# EasyEDA schematic SCH_3-14-Pi-day-PCB_2024-06-02.json
TITLE: Sheet_1; REV: 1.0; Date: 2024-03-14; Sheet: 1/1; Drawn By: emaildivyagarg; Company: Your Company
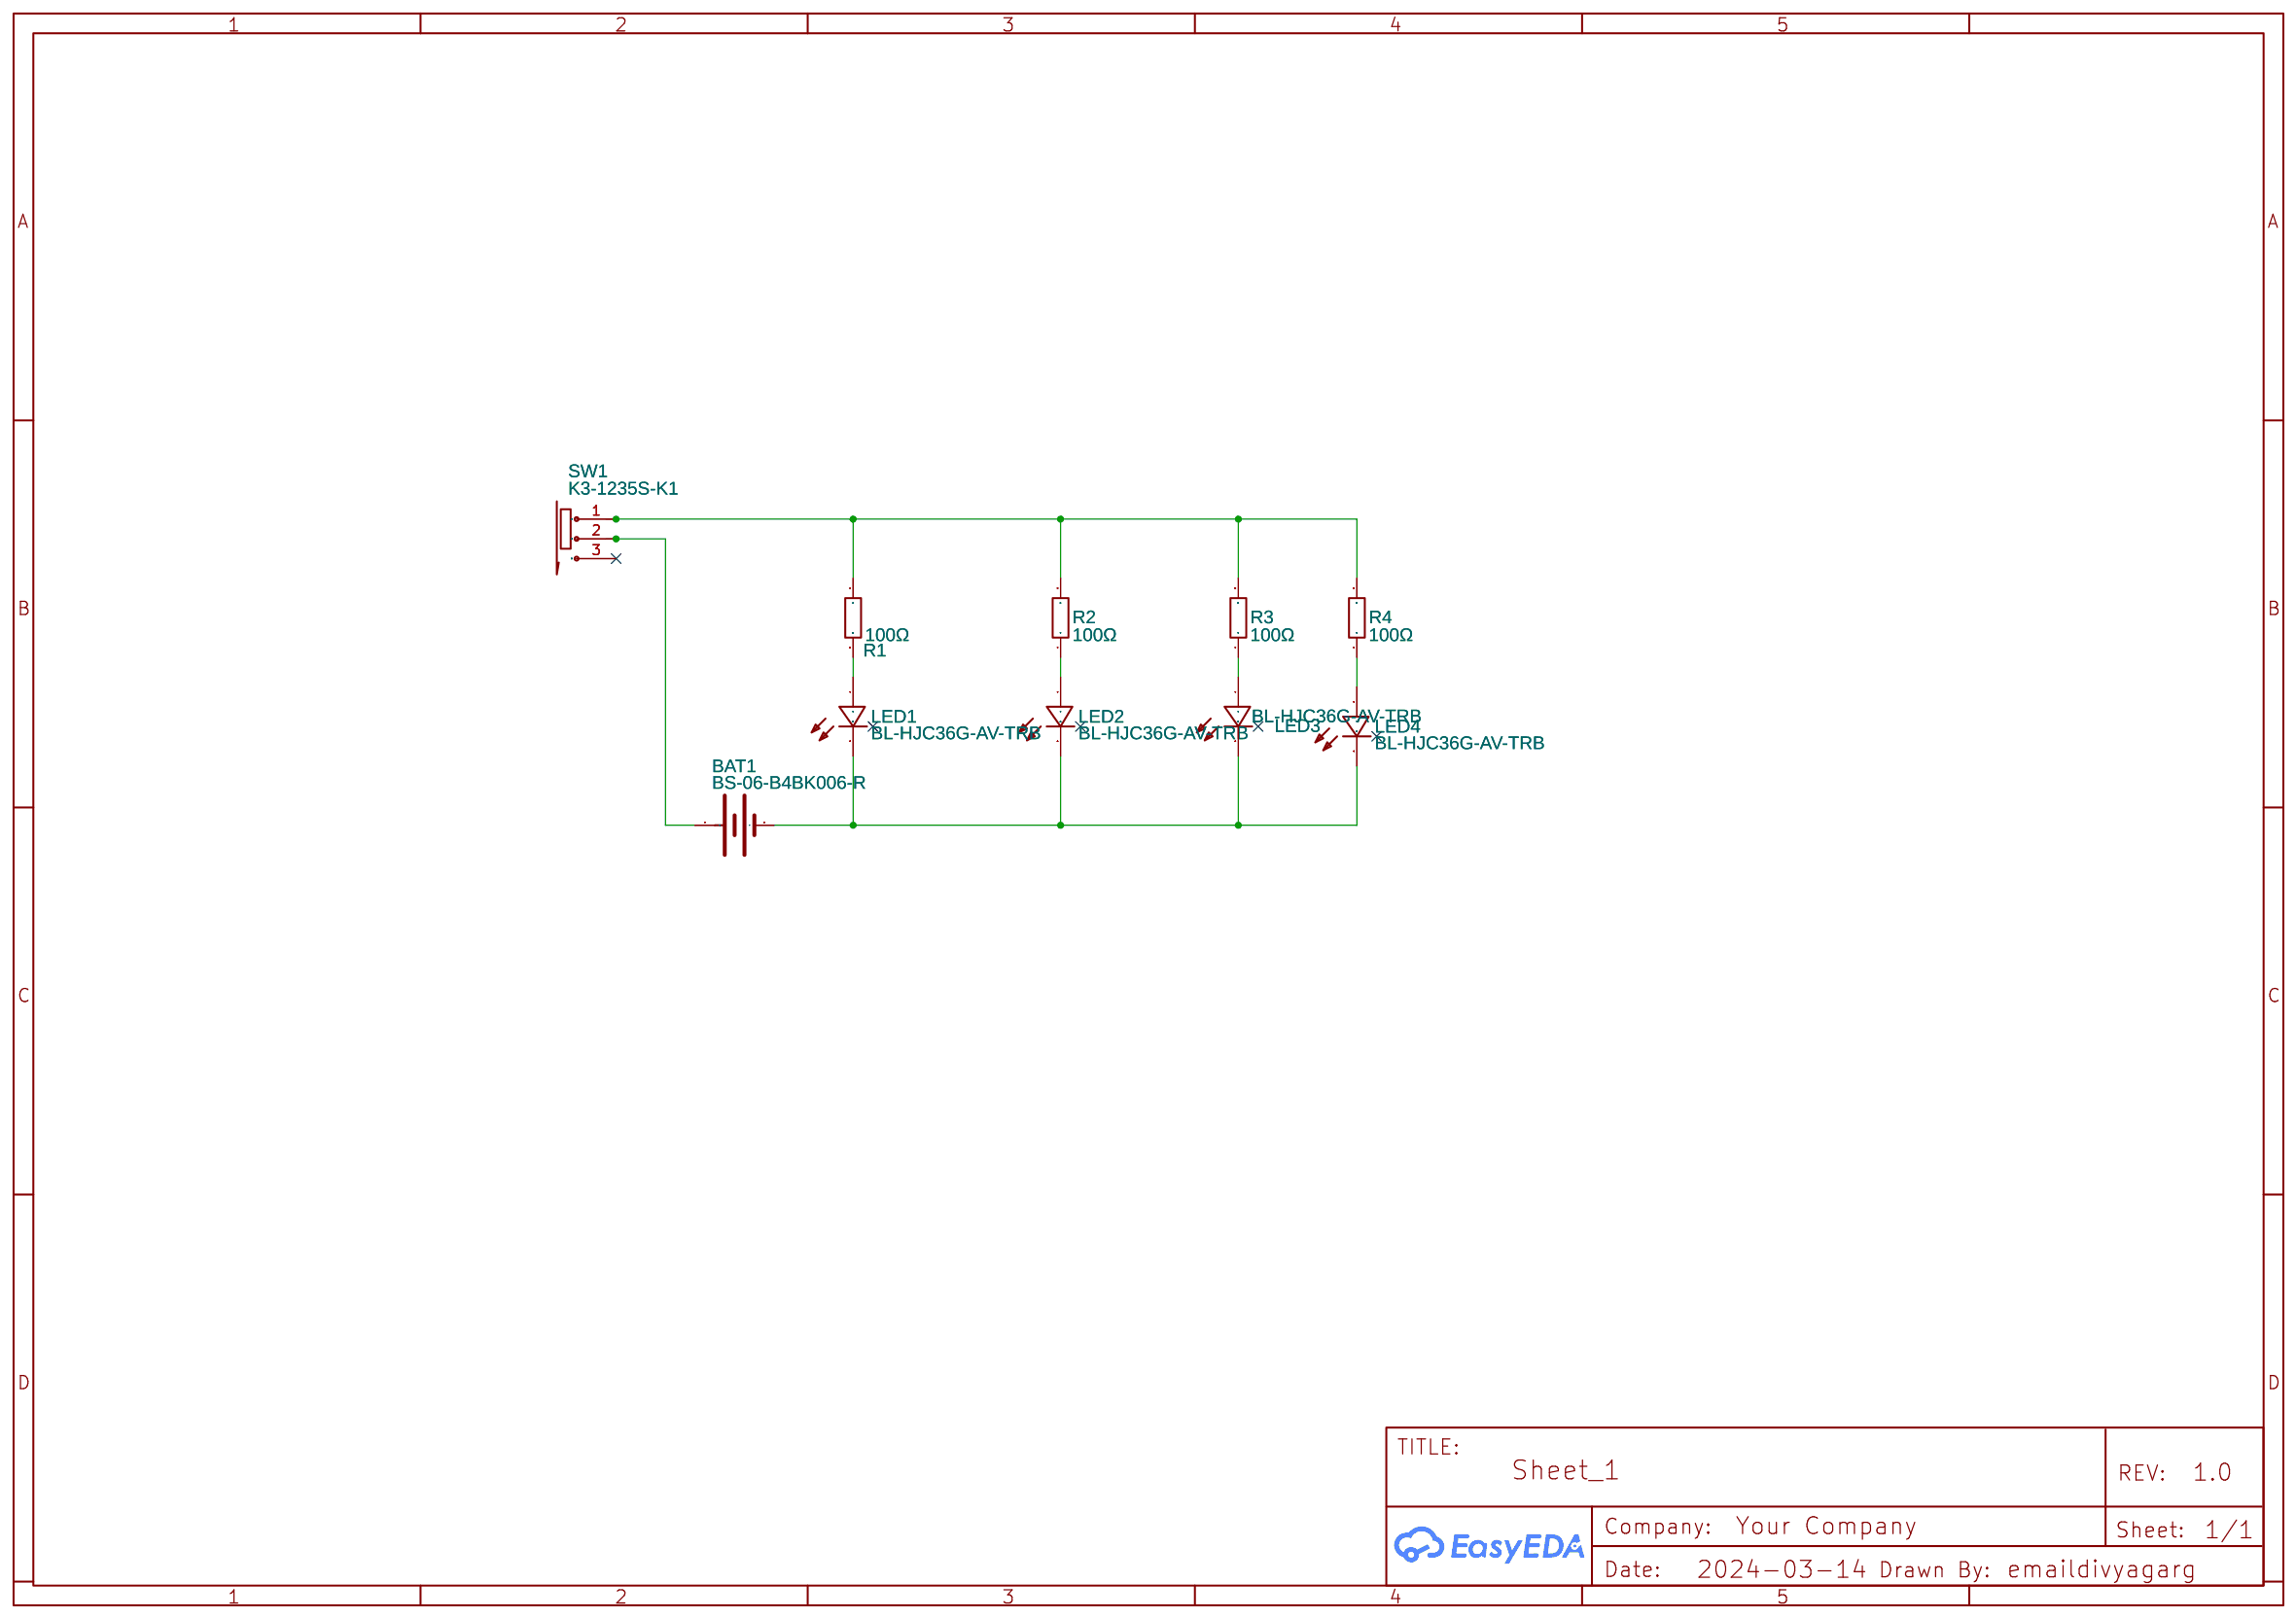
[diagram p0: schematic sheet]

## Parts
BAT1  BS-06-B4BK006-R  [BAT-SMD_BS-06-B4BK006]
LED1  BL-HJC36G-AV-TRB  [LED0603-R-RD_AMBER]
LED2  BL-HJC36G-AV-TRB  [LED0603-R-RD_AMBER]
LED3  BL-HJC36G-AV-TRB  [LED0603-R-RD_AMBER]
LED4  BL-HJC36G-AV-TRB  [LED0603-R-RD_AMBER]
R1  100Ω  [R2512]
R2  100Ω  [R2512]
R3  100Ω  [R2512]
R4  100Ω  [R2512]
SW1  K3-1235S-K1  [SW-SMD_K3-1235S-K1]

## Library data of the parts
BAT1 = BS-06-B4BK006-R: Contributor: lcsc; Supplier: LCSC; Supplier Part: C964765; Manufacturer: MYOUNG(美阳); JLCPCB Part Class: Extended Part
LED1-LED4 = BL-HJC36G-AV-TRB: Contributor: LCSC; Supplier: LCSC; Supplier Part: C165983; Manufacturer: BrtLed(佰鸿); JLCPCB Part Class: Extended Part
R1-R4 = 25121WF1000T4E: Supplier: LCSC; Manufacturer: UNI-ROYAL(厚声); Supplier Part: C35218; JLCPCB Part Class: Extended Part
SW1 = K3-1235S-K1: Contributor: LCSC; Supplier: LCSC; Supplier Part: C223837; Manufacturer: 韩国韩荣; JLCPCB Part Class: Extended Part

## Nets
Net-(BAT1-1): BAT1.1(+) SW1.2
Net-(BAT1-2): BAT1.2(-) LED1.2(C) LED2.2(C) LED3.2(C) LED4.2(C)
Net-(LED1-1): LED1.1(A) R1.2
Net-(LED2-1): LED2.1(A) R2.1
Net-(LED3-1): LED3.1(A) R3.1
Net-(LED4-1): LED4.1(A) R4.1
Net-(R1-1): R1.1 R2.2 R3.2 R4.2 SW1.1

Not connected (* = marked no-connect by the designer): SW1 3*
